# EAGLE design 国技館マトリクスLED制御器 (EAGLE 9.6.2)
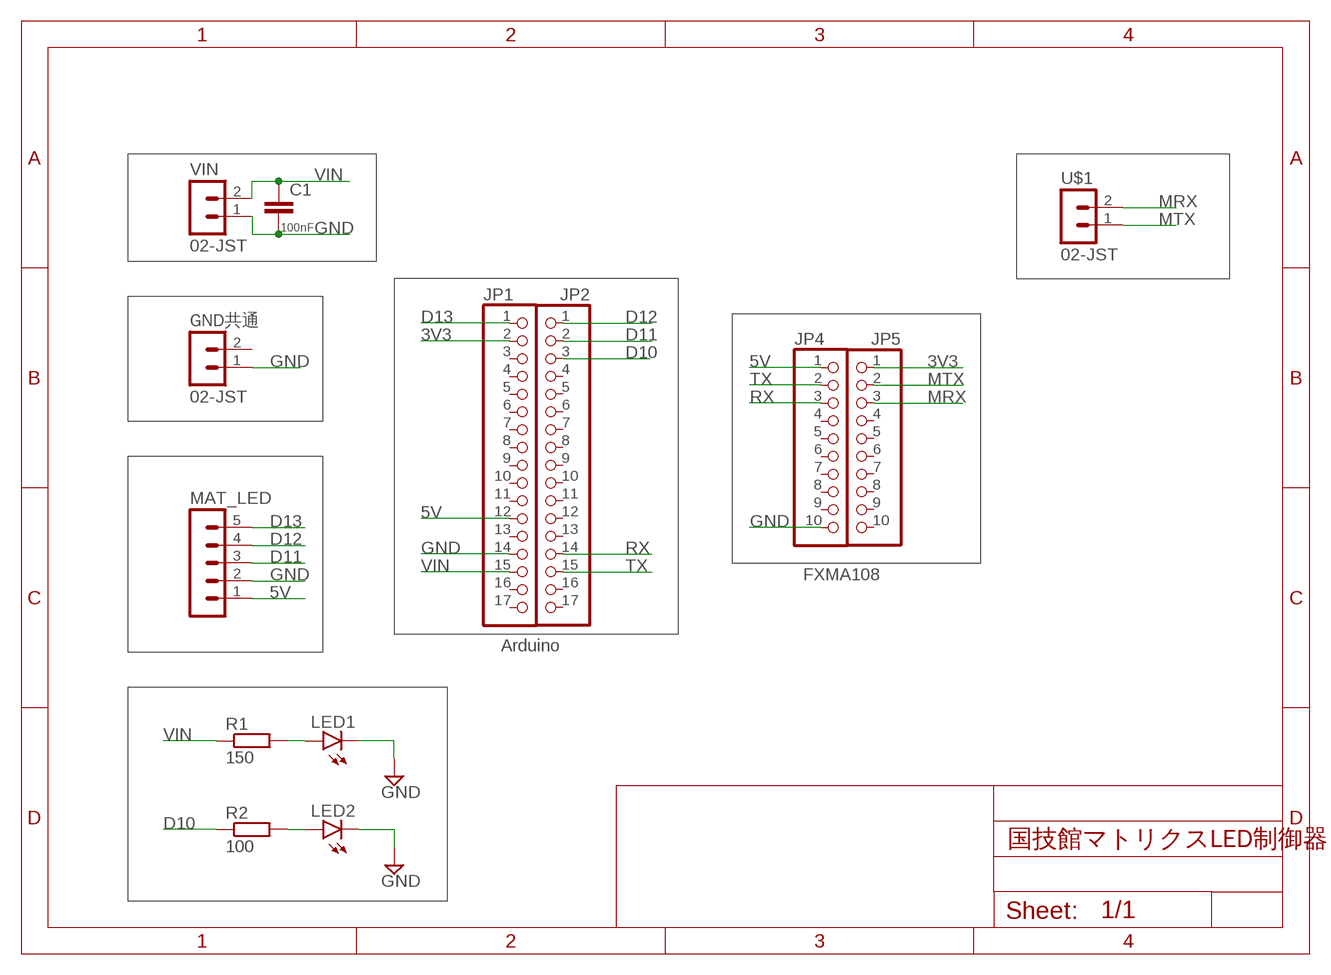
[diagram p0: schematic, sheet 1]

## Parts
C1  100nF  C-EU025-024X044  [C025-024X044]
GND共通  02-JST  [B2B-XH]
JP1  PINHD-1X17  [1X17]
JP2  PINHD-1X17  [1X17]
JP4  PINHD-1X10  [1X10]
JP5  PINHD-1X10  [1X10]
LED1  LED3MM  [LED3MM]
LED2  LED3MM  [LED3MM]
MAT_LED  05-JST  [B5B-XH]
R1  150  R-EU_0204/7  [0204/7]
R2  100  R-EU_0204/7  [0204/7]
U$1  02-JST  [B2B-XH]
VIN  02-JST  [B2B-XH]

## Nets
3V3: JP1.2 JP5.1
5V: JP1.12 JP4.1 MAT_LED.1
D10: JP2.3 R2.1
D11: JP2.2 MAT_LED.3
D12: JP2.1 MAT_LED.4
D13: JP1.1 MAT_LED.5
GND: C1.2 GND共通.1 JP1.14 JP4.10 LED1.K(C) LED2.K(C) MAT_LED.2 VIN.1
MRX: JP5.3 U$1.2
MTX: JP5.2 U$1.1
N$1: LED1.A R1.2
N$2: LED2.A R2.2
RX: JP2.14 JP4.3
TX: JP2.15 JP4.2
VIN: C1.1 JP1.15 R1.1 VIN.2
Unconnected: GND共通.2 JP1.3 JP1.4 JP1.5 JP1.6 JP1.7 JP1.8 JP1.9 JP1.10 JP1.11 JP1.13 JP1.16 JP1.17 JP2.4 JP2.5 JP2.6 JP2.7 JP2.8 JP2.9 JP2.10 JP2.11 JP2.12 JP2.13 JP2.16 JP2.17 JP4.4 JP4.5 JP4.6 JP4.7 JP4.8 JP4.9 JP5.4 JP5.5 JP5.6 JP5.7 JP5.8 JP5.9 JP5.10

## Notes on the sheet
- FXMA108
- Arduino

## Library data of the parts
C1 = rcl:C-EU: CAPACITOR, European symbol; SPICEPREFIX: C
GND共通 U$1 VIN = con-jst-xh:02-JST: JST CONNECTOR
JP1 JP2 = pinhead:PINHD-1X17: PIN HEADER
JP4 JP5 = pinhead:PINHD-1X10: PIN HEADER
LED1 LED2 = led:LED: LED OSRAM: - CHIPLED LG R971, LG N971, LY N971, LG Q971, LY Q971, LO R971, LY R971 LH N974, LH R974 LS Q976, LO Q976, LY Q976 LO Q996 - Hyper CHIPLED LW Q18S LB Q993, LB Q99A, LB R99A - SideLED LS A670, LO A670, LY A670, LG A670, LP A670 LB A673, LV A673, LT A673, LW A673 LH A674 LY A675 LS A676, LA A676, LO A676, LY A676, LW A676 LS A679, LY A679, LG A679 - Hyper Micro SIDELED® LS Y876, LA Y876, LO Y876, LY Y876 LT Y87S - SmartLED LW L88C, LW L88S LB L89C, LB L89S, LG L890 LS L89K, LO L89K, LY L89K LS L896, LA L896, LO L896, LY L896 - TOPLED LS T670, LO T670, LY T670, LG T670, LP T670 LSG T670, LSP T670, LSY T670, LOP T670, LYG T670 LG T671, LOG T671, LSG T671 LB T673, LV T673, LT T673, LW T673 LH T674 LS T676, LA T676, LO T676, LY T676, LB T676, LH T676, LSB T676, LW T676 LB T67C, LV T67C, LT T67C, LS T67K, LO T67K, LY T67K, LW E67C LS E67B, LA E67B, LO E67B, LY E67B, LB E67C, LV E67C, LT E67C LW T67C LS T679, LY T679, LG T679 LS T770, LO T770, LY T770, LG T770, LP T770 LB T773, LV T773, LT T773, LW T773 LH T774 LS E675, LA E675, LY E675, LS T675 LS T776, LA T776, LO T776, LY T776, LB T776 LHGB T686 LT T68C, LB T68C - Hyper Mini TOPLED® LB M676 - Mini TOPLED Santana® LG M470 LS M47K, LO M47K, LY M47K Source: http://www.osram.convergy.de LUXEON: - LUMILED® LXK2-PW12-R00, LXK2-PW12-S00, LXK2-PW14-U00, LXK2-PW14-V00 LXK2-PM12-R00, LXK2-PM12-S00, LXK2-PM14-U00 LXK2-PE12-Q00, LXK2-PE12-R00, LXK2-PE12-S00, LXK2-PE14-T00, LXK2-PE14-U00 LXK2-PB12-K00, LXK2-PB12-L00, LXK2-PB12-M00, LXK2-PB14-N00, LXK2-PB14-P00, LXK2-PB14-Q00 LXK2-PR12-L00, LXK2-PR12-M00, LXK2-PR14-Q00, LXK2-PR14-R00 LXK2-PD12-Q00, LXK2-PD12-R00, LXK2-PD12-S00 LXK2-PH12-R00, LXK2-PH12-S00 LXK2-PL12-P00, LXK2-PL12-Q00, LXK2-PL12-R00 Source: www.luxeon.com KINGBRIGHT: KA-3528ASYC Source: www.kingbright.com
MAT_LED = con-jst-xh:05-JST: JST CONNECTOR
R1 R2 = rcl:R-EU_: RESISTOR, European symbol; SPICEPREFIX: R

## Board
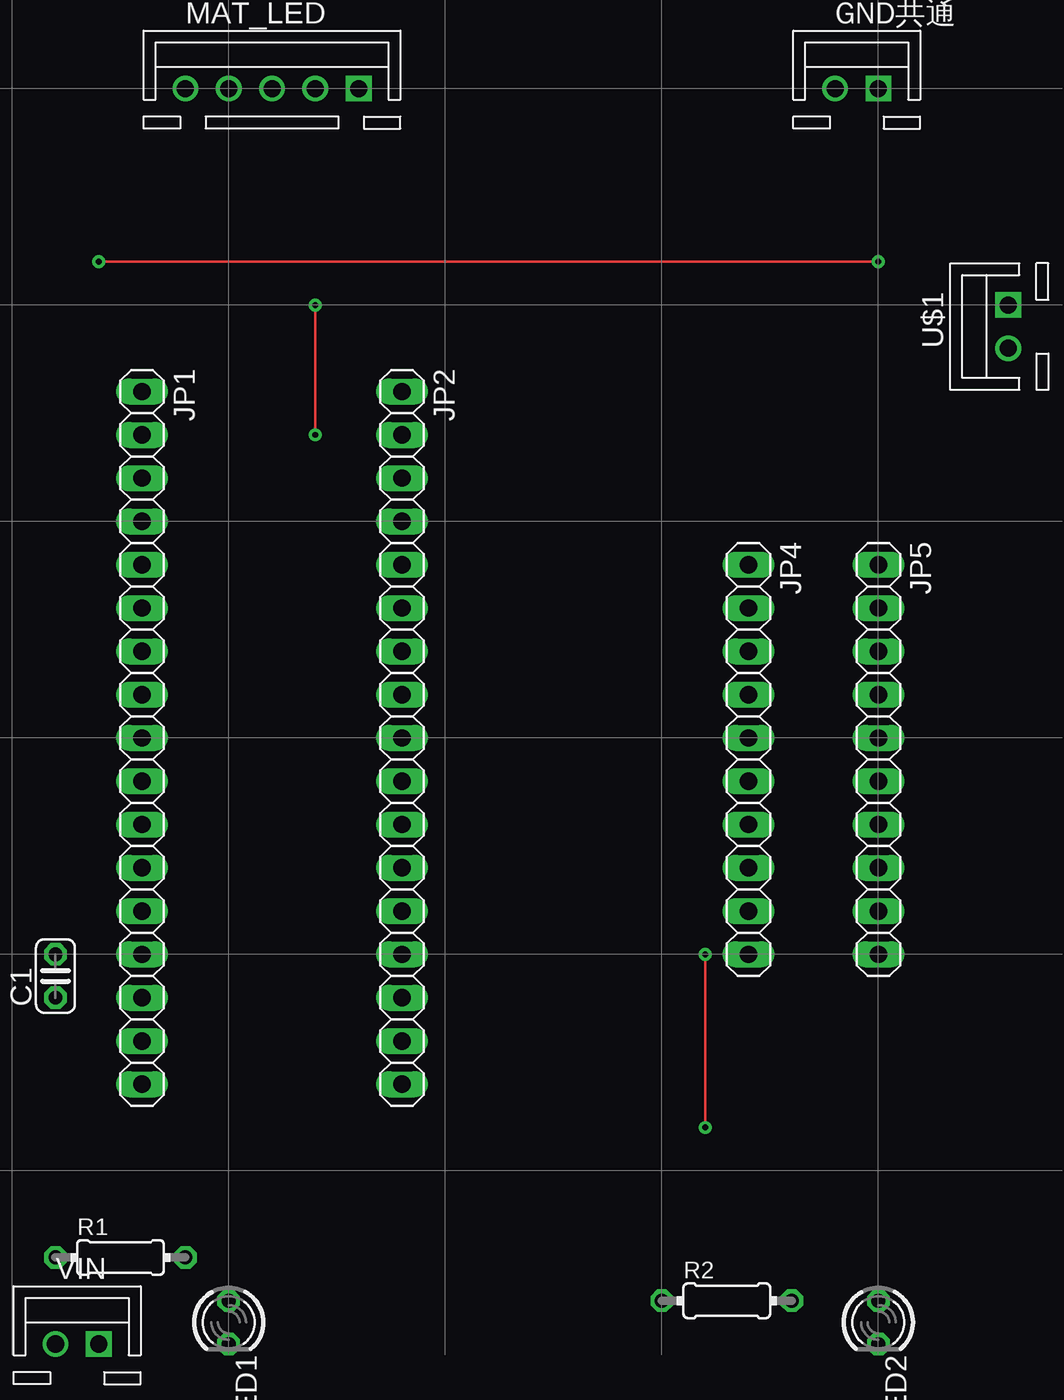
[diagram p1: board, top side]
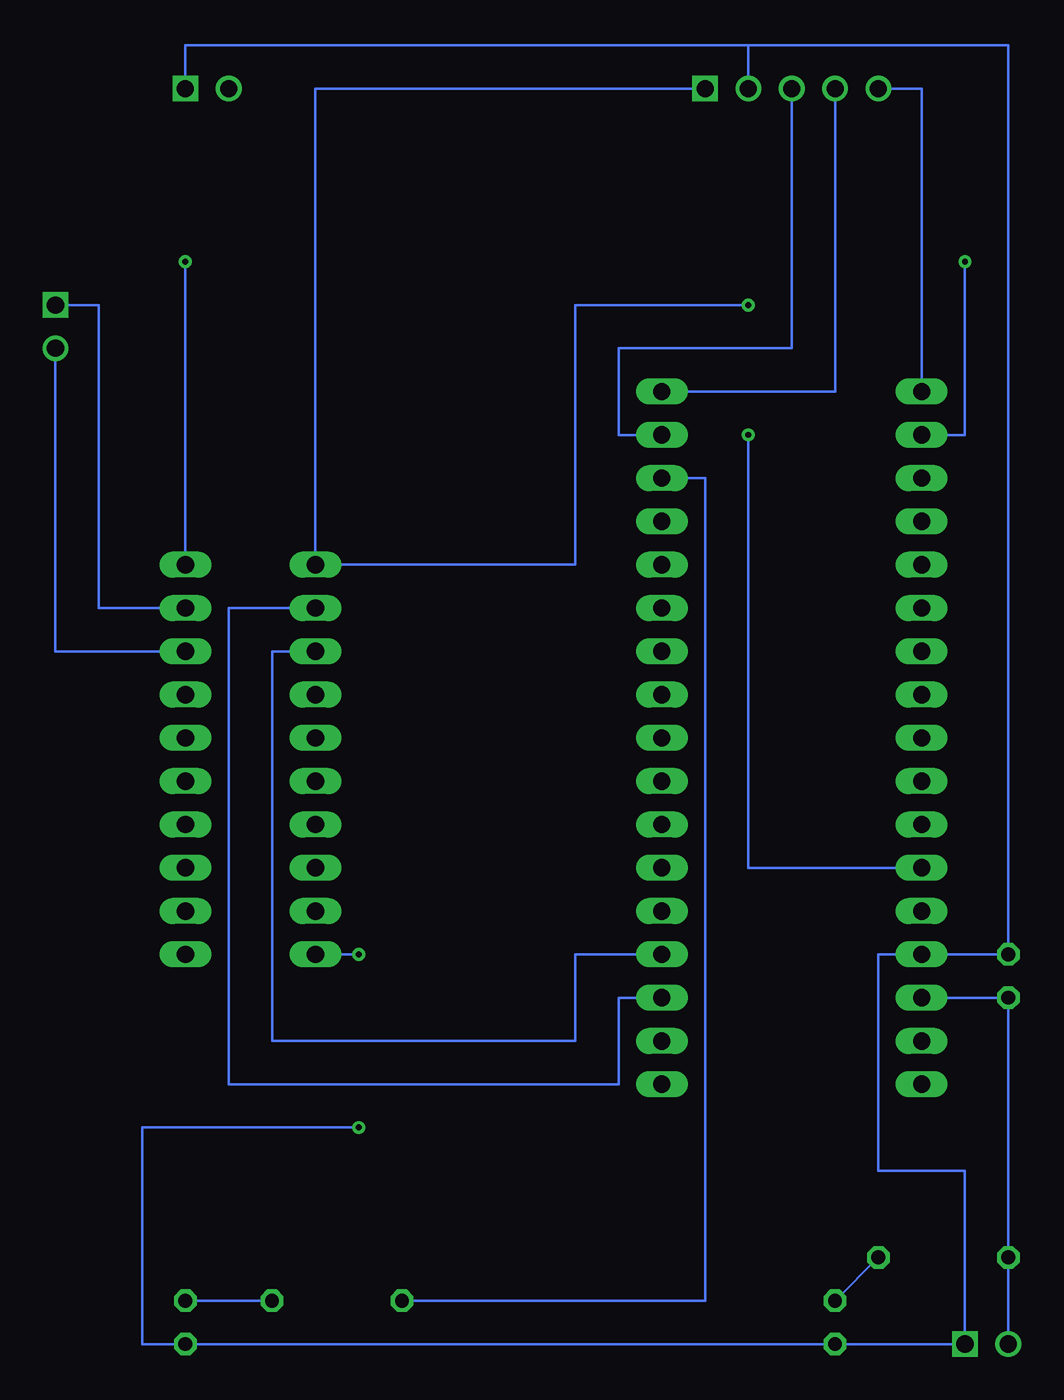
[diagram p2: board, bottom side, seen from below]

No outline drawn. Coordinates in mm, seen from the top.
Copper layers (1*16): Top 0.035mm / dielectric 1.5mm / Bottom 0.035mm
Design rules "default": minimum track width 6mil, minimum drill 0.35mm, track to track 6mil, track to pad 6mil, pad to pad 6mil, via to via 6mil, smd to smd 6mil, copper to edge 40mil, drill to drill 6mil, minimum pad ring 10mil, minimum via ring 8mil, stop-mask expansion 4mil, vias tented up to drill 0mil, thermal gap 10mil

### Footprints (pad centres in the part's own frame; a part is rotated, then mirrored left to right if it is on the bottom)
C025-024X044 = drill 0.813 octagon: 1 -1.27,0; 2 1.27,0
B2B-XH = drill 1 square: 1 1.27,0 | drill 1: 2 -1.27,0
1X17 = drill 1.016 long: 1 -20.32,0; 2 -17.78,0; 3 -15.24,0; 4 -12.7,0; 5 -10.16,0; 6 -7.62,0; 7 -5.08,0; 8 -2.54,0; 9 0,0; 10 2.54,0; 11 5.08,0; 12 7.62,0; 13 10.16,0; 14 12.7,0; 15 15.24,0; 16 17.78,0; 17 20.32,0
1X10 = drill 1.016 long: 1 -11.43,0; 2 -8.89,0; 3 -6.35,0; 4 -3.81,0; 5 -1.27,0; 6 1.27,0; 7 3.81,0; 8 6.35,0; 9 8.89,0; 10 11.43,0
LED3MM = drill 0.813 octagon: A -1.27,0; K 1.27,0
B5B-XH = drill 1 square: 1 5.08,0 | drill 1: 2 2.54,0; 3 0,0; 4 -2.54,0; 5 -5.08,0
0204/7 = drill 0.813 octagon: 1 -3.81,0; 2 3.81,0

### Placement (x,y rotation side)
C1  10.16,24.13 90 top
GND共通  57.15,76.2 0 top
JP1  15.24,38.1 270 top
JP2  30.48,38.1 270 top
JP4  50.8,36.83 270 top
JP5  58.42,36.83 270 top
LED1  20.32,3.81 270 top
LED2  58.42,3.81 270 top
MAT_LED  22.86,76.2 0 top
R1  13.97,7.62 0 top
R2  49.53,5.08 0 top
U$1  66.04,62.23 90 top
U$2  [TYPE.B]  71.12,0 90 top
VIN  11.43,2.54 0 top

### Tracks (layer width: path | path; a pad name or v marks a point on that pad's centre or on a via)
3V3  (via drill 0.35)
  Top 0.152: v58.42,66.04 v12.7,66.04
  Bottom 0.152: JP1.2 12.7,55.88 v12.7,66.04 | v58.42,66.04 JP5.1
5V  (via drill 0.35)
  Top 0.152: v25.4,63.5 v25.4,55.88
  Bottom 0.152: MAT_LED.1 50.8,76.2 JP4.1 35.56,48.26 35.56,63.5 v25.4,63.5 | v25.4,55.88 25.4,30.48 JP1.12
D10
  Bottom 0.152: R2.1 27.94,5.08 27.94,53.34 JP2.3
D11
  Bottom 0.152: MAT_LED.3 22.86,60.96 33.02,60.96 33.02,55.88 JP2.2
D12
  Bottom 0.152: MAT_LED.4 20.32,58.42 JP2.1
D13
  Bottom 0.152: MAT_LED.5 15.24,76.2 JP1.1
GND  (via drill 0.35)
  Top 0.152: v48.26,15.24 v48.26,25.4
  Bottom 0.152: MAT_LED.2 25.4,78.74 | 25.4,78.74 58.42,78.74 GND共通.1 | 25.4,78.74 10.16,78.74 C1.2 JP1.14 17.78,25.4 17.78,12.7 12.7,12.7 VIN.1 LED1.K LED2.K 60.96,2.54 60.96,15.24 v48.26,15.24 | v48.26,25.4 JP4.10
MRX
  Bottom 0.152: JP5.3 66.04,43.18 U$1.2
MTX
  Bottom 0.152: JP5.2 63.5,45.72 63.5,63.5 U$1.1
N$1
  Bottom 0.152: LED1.A R1.2
N$2
  Bottom 0.152: LED2.A R2.2
RX
  Bottom 0.152: JP4.3 53.34,43.18 53.34,20.32 35.56,20.32 35.56,25.4 JP2.14
TX
  Bottom 0.152: JP2.15 33.02,22.86 33.02,17.78 55.88,17.78 55.88,45.72 JP4.2
VIN
  Bottom 0.152: VIN.2 R1.1 C1.1 JP1.15